# Altium schematic sheet 04.LemonAutopilot_4.SchDoc
size A4
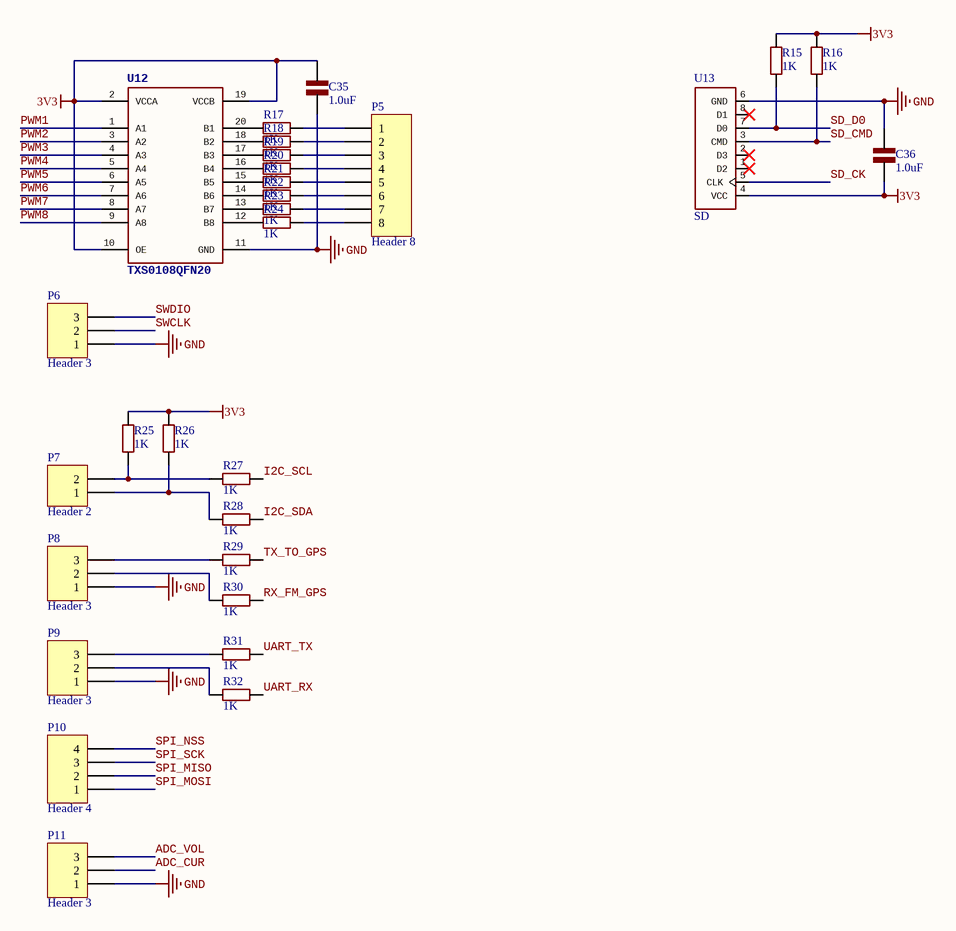
[diagram p0: 04.LemonAutopilot_4.SchDoc]

## Parts
C35  1.0uF  [0603_C]
C36  1.0uF  [0603_C]
P5  Header 8  [HDR1X8]
P6  Header 3  [HDR1X3]
P7  Header 2  [HDR1X2]
P8  Header 3  [HDR1X3]
P9  Header 3  [HDR1X3]
P10  Header 4  [HDR1X4]
P11  Header 3  [HDR1X3]
R15  1K  [0603_R]
R16  1K  [0603_R]
R17  1K  [0603_R]
R18  1K  [0603_R]
R19  1K  [0603_R]
R20  1K  [0603_R]
R21  1K  [0603_R]
R22  1K  [0603_R]
R23  1K  [0603_R]
R24  1K  [0603_R]
R25  1K  [0603_R]
R26  1K  [0603_R]
R27  1K  [0603_R]
R28  1K  [0603_R]
R29  1K  [0603_R]
R30  1K  [0603_R]
R31  1K  [0603_R]
R32  1K  [0603_R]
U12  TXS0108QFN20  [QFN20-RGY]
U13  SD

## Nets
3V3: C35.2 C36.1 R15.1 R16.1 R25.1 R26.1 U12.2(VCCA) U12.10(OE) U12.19(VCCB) U13.4(VCC)
GND: C35.1 C36.2 P6.1 P8.1 P9.1 P11.1 U12.11(GND) U13.6(GND)
ADC_CUR: P11.2
ADC_VOL: P11.3
I2C_SCL: R27.2
I2C_SDA: R28.2
PWM1: U12.1(A1)
PWM2: U12.3(A2)
PWM3: U12.4(A3)
PWM4: U12.5(A4)
PWM5: U12.6(A5)
PWM6: U12.7(A6)
PWM7: U12.8(A7)
PWM8: U12.9(A8)
RX_FM_GPS: R30.2
SD_CK: U13.5(CLK)
SD_CMD: R16.2 U13.3(CMD)
SD_D0: R15.2 U13.7(D0)
SPI_MISO: P10.2
SPI_MOSI: P10.1
SPI_NSS: P10.4
SPI_SCK: P10.3
SWCLK: P6.2
SWDIO: P6.3
TX_TO_GPS: R29.2
UART_RX: R32.2
UART_TX: R31.2
NetP5_1: P5.1 R17.2
NetP5_2: P5.2 R18.2
NetP5_3: P5.3 R19.2
NetP5_4: P5.4 R20.2
NetP5_5: P5.5 R21.2
NetP5_6: P5.6 R22.2
NetP5_7: P5.7 R23.2
NetP5_8: P5.8 R24.2
NetP7_1: P7.1 R26.2 R28.1
NetP7_2: P7.2 R25.2 R27.1
NetP8_2: P8.2 R30.1
NetP8_3: P8.3 R29.1
NetP9_2: P9.2 R32.1
NetP9_3: P9.3 R31.1
NetR17_1: R17.1 U12.20(B1)
NetR18_1: R18.1 U12.18(B2)
NetR19_1: R19.1 U12.17(B3)
NetR20_1: R20.1 U12.16(B4)
NetR21_1: R21.1 U12.15(B5)
NetR22_1: R22.1 U12.14(B6)
NetR23_1: R23.1 U12.13(B7)
NetR24_1: R24.1 U12.12(B8)

Not connected (* = marked no-connect by the designer): U13 1(D2)* 2(D3)* 8(D1)*

## Library data of the parts
C35 C36 = C0603
P5 = Header 8: Header, 8-Pin; LatestRevisionDate: 17-Jul-2002; LatestRevisionNote: Re-released for DXP Platform.; Publisher: Altium Limited
P6 P8 P9 P11 = Header 3: Header, 3-Pin; LatestRevisionDate: 17-Jul-2002; LatestRevisionNote: Re-released for DXP Platform.; Publisher: Altium Limited
P7 = Header 2: Header, 2-Pin; LatestRevisionDate: 17-Jul-2002; LatestRevisionNote: Re-released for DXP Platform.; Publisher: Altium Limited
P10 = Header 4: Header, 4-Pin; LatestRevisionDate: 17-Jul-2002; LatestRevisionNote: Re-released for DXP Platform.; Publisher: Altium Limited
R15-R32 = R0603